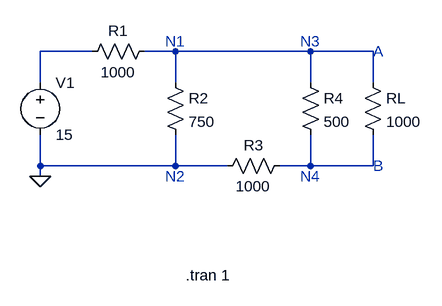
[diagram p0: schematic Lab 5.asc]
Lab 5.asc, the LTspice schematic file:
Version 4
SHEET 1 880 680
WIRE -240 32 -320 32
WIRE -112 32 -160 32
WIRE 96 32 -112 32
WIRE 192 32 96 32
WIRE -320 80 -320 32
WIRE -112 80 -112 32
WIRE 96 80 96 32
WIRE 192 80 192 32
WIRE -320 208 -320 160
WIRE -112 208 -112 160
WIRE -112 208 -320 208
WIRE -32 208 -112 208
WIRE 96 208 96 160
WIRE 96 208 48 208
WIRE 192 208 192 160
WIRE 192 208 96 208
WIRE -320 224 -320 208
FLAG -320 224 0
SYMBOL voltage -320 64 R0
WINDOW 123 0 0 Left 2
WINDOW 39 0 0 Left 2
SYMATTR InstName V1
SYMATTR Value 15
SYMBOL res -256 48 R270
WINDOW 0 32 56 VTop 2
WINDOW 3 0 56 VBottom 2
SYMATTR InstName R1
SYMATTR Value 1000
SYMBOL res -128 64 R0
SYMATTR InstName R2
SYMATTR Value 750
SYMBOL res 64 192 R90
WINDOW 0 0 56 VBottom 2
WINDOW 3 32 56 VTop 2
SYMATTR InstName R3
SYMATTR Value 1000
SYMBOL res 80 64 R0
SYMATTR InstName R4
SYMATTR Value 500
SYMBOL res 176 64 R0
SYMATTR InstName RL
SYMATTR Value 1000
TEXT -96 376 Left 2 !.tran 1
TEXT -128 16 Left 2 ;N1
TEXT -128 224 Left 2 ;N2
TEXT 80 16 Left 2 ;N3
TEXT 80 224 Left 2 ;N4
TEXT 192 32 Left 2 ;A
TEXT 192 208 Left 2 ;B

The netlist it stands for:
* Lab 5.asc
V1 N001 0 15
R1 N001 N002 1000
R2 N002 0 750
R3 N003 0 1000
R4 N002 N003 500
RL N002 N003 1000
.tran 1
* N1
* N2
* N3
* N4
* A
* B
.backanno
.end